# Altium schematic sheet Power management.SchDoc: Power Managemant
size A4; DocumentNumber: 2; SheetNumber: 2; SheetTotal: 3
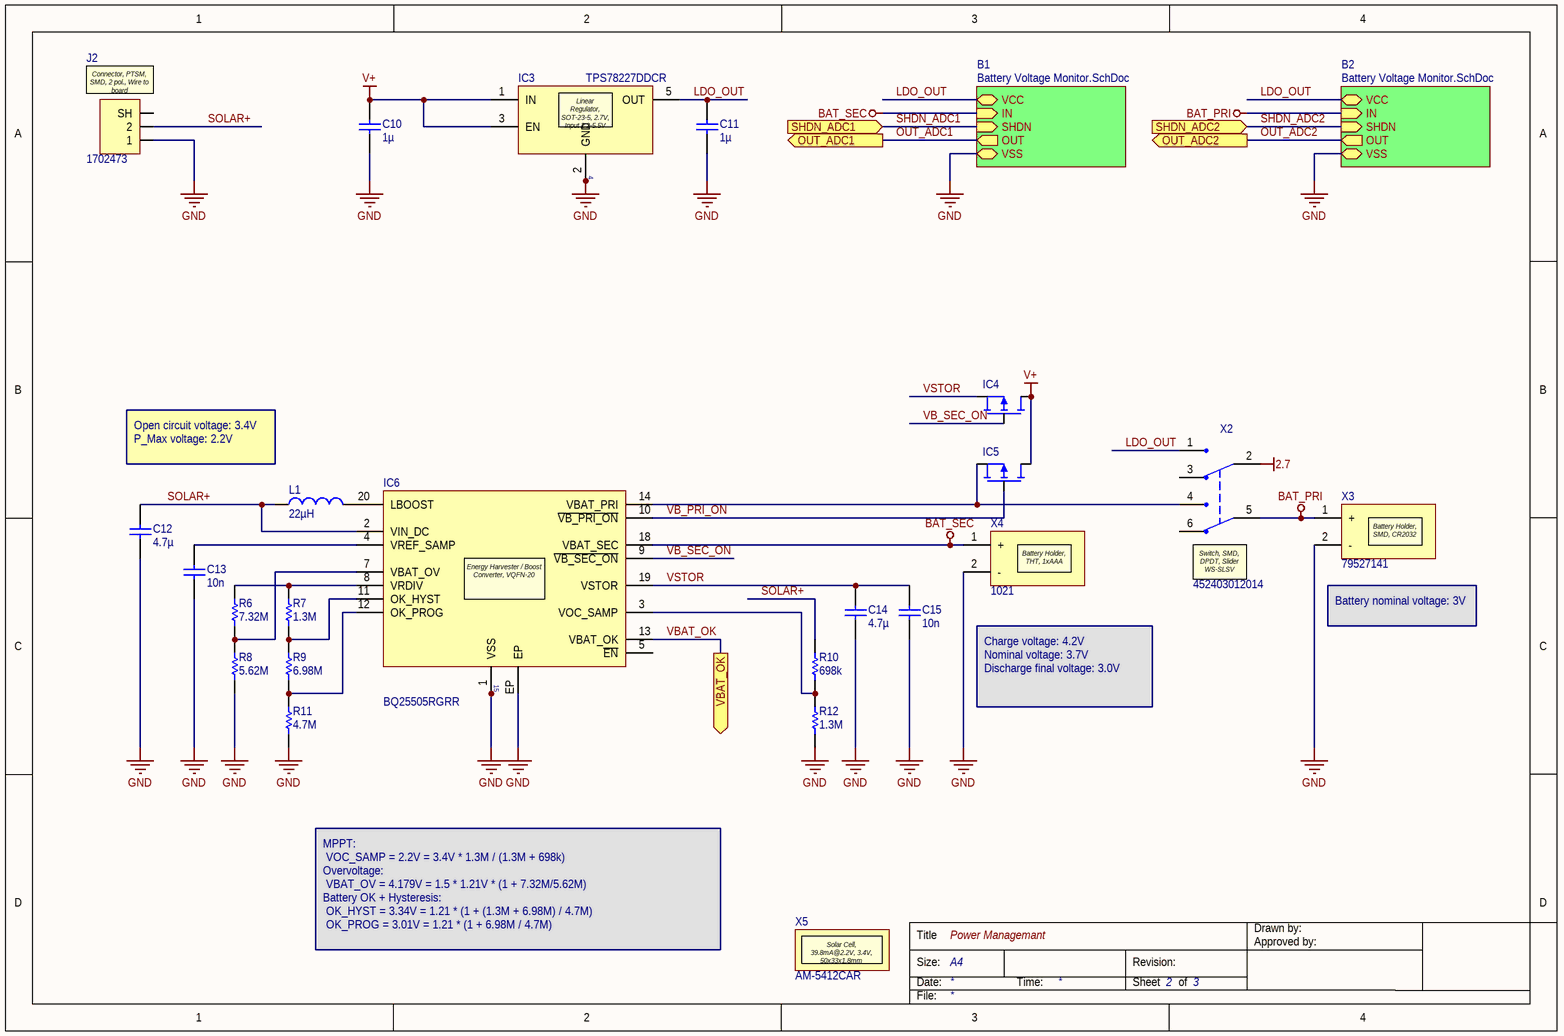
[diagram p0: Power management.SchDoc]

## Parts
C10  value 1µ  [C0805]  (hidden comment: GRM21BR71H105KA12L)
C11  value 1µ  [C0805]  (hidden comment: GRM21BR71H105KA12L)
C12  value 4.7µ  [C0603]  (hidden comment: C0603C475M8PACTU)
C13  value 10n  [C0603]  (hidden comment: C0603C103J3GACTU)
C14  value 4.7µ  [C0603]  (hidden comment: C0603C475M8PACTU)
C15  value 10n  [C0603]  (hidden comment: C0603C103J3GACTU)
IC3  TPS78227DDCR  [SOT-23-5]
IC4  PMZ950UPEL  [SOT-883]  (value not drawn)
IC5  PMZ950UPEL  [SOT-883]  (value not drawn)
IC6  BQ25505RGRR  [VQFN-20-EP_3.5x3.5]
J2  1702473  [1702473]
L1  value 22µH  [WE-TCP_3816]  (hidden comment: 744031220)
R6  value 7.32M  [R0603]  (hidden comment: CRCW06037M32FKEA)
R7  value 1.3M  [R0603]  (hidden comment: CRCW06031M30FKEA)
R8  value 5.62M  [R0603]  (hidden comment: CRCW06035M62FKEA)
R9  value 6.98M  [R0603]  (hidden comment: CRCW06036M98FKEA)
R10  value 698k  [R0603]  (hidden comment: ERJ-3EKF6983V)
R11  value 4.7M  [R0603]  (hidden comment: CRCW06034M70FKEA)
R12  value 1.3M  [R0603]  (hidden comment: CRCW06031M30FKEA)
X2  452403012014  [452403012014]
X3  79527141  [79527141]  (graphical)
X4  MPN: 1021  [Keystone_Electronics_1021]  (hidden comment: Keystone_Electronics_1021)
X5  AM-5412CAR  [AM-5412CAR]

## Sub-sheets
B1 = Battery Voltage Monitor.SchDoc: VCC, VSS, SHDN (in), OUT (out), IN (in)
B2 = Battery Voltage Monitor.SchDoc: VCC, VSS, SHDN (in), OUT (out), IN (in)

## Ports
OUT_ADC1 (out), OUT_ADC2 (out), SHDN_ADC1 (in), SHDN_ADC2 (in), VBAT_OK (out)

## Nets
2.7: X2.2(COM1)
BAT_PRI: X2.5(COM2) X3.1(+) ; sheet B2/IN
BAT_SEC: IC6.18(VBAT_SEC) X4.1(+) ; sheet B1/IN
GND: C10.1 C11.1 C12.1 C13.1 C14.1 C15.1 IC3.2(GND) IC3.4(GND) IC6.1(VSS) IC6.15(VSS) IC6.EP J2.1 R8.1 R11.1 R12.1 X3.2(-) X4.2(-) ; sheet B1/VSS, sheet B2/VSS
V+: C10.2 IC3.1(IN) IC3.3(EN) IC4.3(D) IC5.3(D)
LDO_OUT: C11.2 IC3.5(OUT) X2.1(NO1) ; sheet B1/VCC, sheet B2/VCC
OUT_ADC1: port OUT_ADC1, sheet B1/OUT
OUT_ADC2: port OUT_ADC2, sheet B2/OUT
SHDN_ADC1: port SHDN_ADC1, sheet B1/SHDN
SHDN_ADC2: port SHDN_ADC2, sheet B2/SHDN
SOLAR+: C12.2 IC6.2(VIN_DC) J2.2 L1.1 R10.2
VB_PRI_ON: IC5.1(G) IC6.10(~{VB_PRI_ON})
VB_SEC_ON: IC4.1(G) IC6.9(~{VB_SEC_ON})
VBAT_OK: IC6.13(VBAT_OK) ; port VBAT_OK
VSTOR: C14.2 C15.2 IC4.2(S) IC6.19(VSTOR)
NetC13_2: C13.2 IC6.4(VREF_SAMP)
NetIC5_2: IC5.2(S) IC6.14(VBAT_PRI) X2.4(NO2)
NetIC6_3: IC6.3(VOC_SAMP) R10.1 R12.2
NetIC6_7: IC6.7(VBAT_OV) R6.1 R8.2
NetIC6_8: IC6.8(VRDIV) R6.2 R7.2
NetIC6_11: IC6.11(OK_HYST) R7.1 R9.2
NetIC6_12: IC6.12(OK_PROG) R9.1 R11.2
NetIC6_20: IC6.20(LBOOST) L1.2
NetJ2_SH1: J2.SH1(SH) J2.SH2

Not connected (* = marked no-connect by the designer): IC6 5(~{EN}); X2 3(NC1) 6(NC2)

## Notes on the sheet
- Open circuit voltage: 3.4V
  P_Max voltage: 2.2V
- (near X3) Battery nominal voltage: 3V
- Charge voltage: 4.2V
  Nominal voltage: 3.7V
  Discharge final voltage: 3.0V
- MPPT:
  VOC_SAMP = 2.2V = 3.4V * 1.3M / (1.3M + 698k)
  Overvoltage:
  VBAT_OV = 4.179V = 1.5 * 1.21V * (1 + 7.32M/5.62M)
  Battery OK + Hysteresis:
  OK_HYST = 3.34V = 1.21 * (1 + (1.3M + 6.98M) / 4.7M)
  OK_PROG = 3.01V = 1.21 * (1 + 6.98M / 4.7M)
- Title
- Size:
- Date:
- A4
- Time:
- Revision:
- Sheet
- of
- Drawn by:
- Approved by:
- File:

## Library data of the parts
C10 C11 = GRM21BR71H105KA12L: Cap, 1µ, 0805, 50V, X7R; Manufacturer: Murata; Rated Voltage: 50V; Dielectric: X7R; Temperature: 125°C; ComponentLink2URL: p:\415379.pdf; ComponentLink1Description: Datasheet; ComponentLink2Description: Part Series Datasheet; ComponentLink1URL: p:\2047800.pdf; OC_FEPA: 1029873; Supplier 1: Digi-Key; Supplier Part Number 1: 490-4736-1-ND; Supplier 2: Farnell; Supplier Part Number 2: 1735541; Supplier 3: Mouser; Supplier Part Number 3: 81-GRM21BR71H105KA2L; MPN: GRM21BR71H105KA12L
C12 C14 = C0603C475M8PACTU: Cap, 4.7µ, 0603, X5R, 10V; Manufacturer: Kemet; Rated Voltage: 10V; Dielectric: X5R; ComponentLink2URL: P:/KEM_C1006_X5R_SMD.pdf; ComponentLink2Description: Part Series Datasheet; OC_FEPA: *; MPN: C0603C475M8PACTU; Supplier 1: Digi-Key; Supplier Part Number 1: 399-9100-1-ND; Supplier 2: Farnell; Supplier Part Number 2: 2112834; Supplier 3: Mouser; Supplier Part Number 3: 80-C0603C475M8P
C13 C15 = C0603C103J3GACTU: Cap, 10n, 0603, C0G, 25V; Manufacturer: Kemet; Rated Voltage: 25V; Dielectric: C0G; ComponentLink2URL: P:/KEM_C1003_C0G_SMD.pdf; ComponentLink2Description: Part Series Datasheet; OC_FEPA: *; MPN: C0603C103J3GACTU; Supplier 1: Digi-Key; Supplier Part Number 1: 399-7838-1-ND; Supplier 2: Farnell; Supplier Part Number 2: 1457729; Supplier 3: Mouser; Supplier Part Number 3: 80-C0603C103J3G
IC3 = TPS78227DDCR: Linear Regulator, SOT-23-5, 2.7V, Input 2.2-5.5V; Manufacturer: Texas Instruments; Additional Description: 130mV Dropout, Ultra low quiescent current; ComponentLink1URL: P:/tps782.pdf; ComponentLink1Description: Datasheet; OC_FEPA: *; Supplier 1: Digi-Key; Supplier Part Number 1: 296-23825-1-ND; Supplier 2: Farnell; Supplier Part Number 2: 2352270; Supplier 3: Mouser; Supplier Part Number 3: 595-TPS78227DDCR; Supplier 4: RSComponents; Supplier Part Number 4: 8175436; MPN: TPS78227DDCR
IC4 IC5 = PMZ950UPEL: MOSFET, SOT-883, p-channel, -20V, -0.5A, low leakage current; Manufacturer: Nexperia; ComponentLink1URL: P:/PMZ950UPEL.pdf; ComponentLink1Description: Datasheet; OC_FEPA: *; Supplier 1: Digi-Key; Supplier Part Number 1: 1727-2599-1-ND; Supplier 2: Farnell; Supplier Part Number 2: 2673080; Supplier 3: Mouser; Supplier Part Number 3: 771-PMZ950UPELYL; MPN: PMZ950UPEL
IC6 = BQ25505RGRR: Energy Harvester / Boost Converter, VQFN-20; Manufacturer: Texas Instruments; ComponentLink1URL: P:/bq25505.pdf; ComponentLink1Description: Datasheet; OC_FEPA: *; MPN: BQ25505RGRR; Supplier 1: Digi-Key; Supplier Part Number 1: 296-37078-1-ND; Supplier 2: Farnell; Supplier Part Number 2: -; Supplier 3: Mouser; Supplier Part Number 3: 595-BQ25505RGRR
J2 = 1702473: Connector, PTSM, SMD, 2 pol., Wire to board; Manufacturer: Phoenix Contact; ComponentLink1URL: P:/1702473.pdf; ComponentLink1Description: Datasheet; OC_FEPA: *; ComponentLink3Description: Drawing; ComponentLink3URL: P:/pxc_1702473_01_PTSM-0-5-2-2-5-H-SMD-R24_FAM.pdf; Supplier 1: Digi-Key; Supplier Part Number 1: 277-2337-1-ND; Supplier 2: Farnell; Supplier Part Number 2: 1793797; Supplier 3: Mouser; Supplier Part Number 3: 651-1702473; MPN: 1702473
L1 = 744031220: Ind, 22µH, 0.51A, 3.8x3.8x1.65mm; Manufacturer: Würth Elektronik; OC_FEPA: *; ComponentLink3Description: Drawing; ComponentLink3URL: P:/744031220.pdf; MPN: 744031220; Supplier 1: Digi-Key; Supplier Part Number 1: 732-1012-1-ND; Supplier 2: Farnell; Supplier Part Number 2: 1890602; Supplier 3: Mouser; Supplier Part Number 3: 710-744031220; Supplier 4: RSComponents; Supplier Part Number 4: 617-0903
R6 = CRCW06037M32FKEA: Res, 7.32M, 0603, 1%, 75V, 100mW; Manufacturer: Vishay Dale; Temperature Coefficient: 100ppm; Rated Voltage: 75V; Tolerance: 1%; Type: Thick Film; Rated Power: 100mW; OC_FEPA: *; ComponentLink2URL: P:/dcrcwe3.pdf; ComponentLink2Description: Part Series Datasheet; MPN: CRCW06037M32FKEA; Supplier 1: Digi-Key; Supplier Part Number 1: 541-7.32MHCT-ND; Supplier 2: Farnell; Supplier Part Number 2: 2138713; Supplier 3: Mouser; Supplier Part Number 3: 71-CRCW06037M32FKEA
R7 R12 = CRCW06031M30FKEA: Res, 1.3M, 0603, 1%, 75V, 100mW; Manufacturer: Vishay Dale; Temperature Coefficient: 100ppm; Rated Voltage: 75V; Tolerance: 1%; Type: Thick Film; Rated Power: 100mW; OC_FEPA: *; ComponentLink2URL: P:/dcrcwe3.pdf; ComponentLink2Description: Part Series Datasheet; MPN: CRCW06031M30FKEA; Supplier 1: Digi-Key; Supplier Part Number 1: 541-1.30MHCT-ND; Supplier 2: Farnell; Supplier Part Number 2: 2138620; Supplier 3: Mouser; Supplier Part Number 3: 71-CRCW06031M30FKEA
R8 = CRCW06035M62FKEA: Res, 5.62M, 0603, 1%, 75V, 100mW; Manufacturer: Vishay Dale; Temperature Coefficient: 100ppm; Rated Voltage: 75V; Tolerance: 1%; Type: Thick Film; Rated Power: 100mW; OC_FEPA: *; ComponentLink2URL: P:/dcrcwe3.pdf; ComponentLink2Description: Part Series Datasheet; MPN: CRCW06035M62FKEA; Supplier 1: Digi-Key; Supplier Part Number 1: 541-5.62MHCT-ND; Supplier 2: Farnell; Supplier Part Number 2: 2138698; Supplier 3: Mouser; Supplier Part Number 3: 71-CRCW06035M62FKEA
R9 = CRCW06036M98FKEA: Res, 6.98M, 0603, 1%, 75V, 100mW; Manufacturer: Vishay Dale; Temperature Coefficient: 100ppm; Rated Voltage: 75V; Tolerance: 1%; Type: Thick Film; Rated Power: 100mW; OC_FEPA: *; ComponentLink2URL: P:/dcrcwe3.pdf; ComponentLink2Description: Part Series Datasheet; MPN: CRCW06036M98FKEA; Supplier 1: Digi-Key; Supplier Part Number 1: 541-6.98MHCT-ND; Supplier 2: Farnell; Supplier Part Number 2: 2138710; Supplier 3: Mouser; Supplier Part Number 3: 71-CRCW06036M98FKEA
R10 = ERJ-3EKF6983V: Res, 698k, 0603, 1%, 75V, 100mW; Manufacturer: Panasonic Electronic Components; Temperature Coefficient: 100ppm; Rated Voltage: 75V; Tolerance: 1%; Type: Thick Film; Rated Power: 100mW; OC_FEPA: *; ComponentLink2URL: P:/AOA0000C304.pdf; ComponentLink2Description: Part Series Datasheet; MPN: ERJ-3EKF6983V; Supplier 1: Digi-Key; Supplier Part Number 1: P698KHCT-ND; Supplier 2: Farnell; Supplier Part Number 2: 2303307; Supplier 3: Mouser; Supplier Part Number 3: 667-ERJ-3EKF6983V
R11 = CRCW06034M70FKEA: Res, 4.7M, 0603, 1%, 75V, 100mW; Manufacturer: Vishay Dale; Temperature Coefficient: 100ppm; Rated Voltage: 75V; Tolerance: 1%; Type: Thick Film; Rated Power: 100mW; OC_FEPA: *; ComponentLink2URL: P:/dcrcwe3.pdf; ComponentLink2Description: Part Series Datasheet; MPN: CRCW06034M70FKEA; Supplier 1: Digi-Key; Supplier Part Number 1: 541-4.70MHCT-ND; Supplier 2: Farnell; Supplier Part Number 2: 2138688; Supplier 3: Mouser; Supplier Part Number 3: 71-CRCW0603-4.7M-E3
X2 = 452403012014: Switch, SMD, DPDT, Slider WS-SLSV; Manufacturer: Würth Elektronik; OC_FEPA: *; ComponentLink3Description: Drawing; ComponentLink3URL: P:/452403012014.pdf; Supplier 1: Digi-Key; Supplier Part Number 1: 732-10145-1-ND; Supplier 2: Farnell; Supplier Part Number 2: -; Supplier 3: Mouser; Supplier Part Number 3: 710-452403012014; MPN: 452403012014
X3 = 79527141: Battery Holder, SMD, CR2032; Manufacturer: Würth Elektronik; OC_FEPA: *; ComponentLink3Description: Drawing; ComponentLink3URL: P:/79527141.pdf; Supplier 1: Digi-Key; Supplier Part Number 1: 732-12325-1-ND; Supplier 2: Farnell; Supplier Part Number 2: -; Supplier 3: Mouser; Supplier Part Number 3: 710-79527141; Supplier 4: RSComponents; Supplier Part Number 4: 1842347; MPN: 79527141
X4 = Keystone_Electronics_1021: Battery Holder, THT, 1xAAA; Manufacturer: Keystone Electronics; OC_FEPA: *; ComponentLink2Description: Part Series Datasheet; ComponentLink2URL: P:/M65p22.pdf; ComponentLink3Description: Drawing; ComponentLink3URL: P:/1021.PDF; Supplier 1: Digi-Key; Supplier Part Number 1: 36-1021-ND; Supplier 2: Farnell; Supplier Part Number 2: -; Supplier 3: Mouser; Supplier Part Number 3: 534-1021; Supplier 4: Conrad; Supplier Part Number 4: 1555480
X5 = AM-5412CAR: Solar Cell, 39.8mA@2.2V, 3.4V, 50x33x1.8mm; Manufacturer: Panasonic BSG; OC_FEPA: *; ComponentLink2Description: Part Series Datasheet; ComponentLink2URL: P:/Amorphous_Br.pdf; Supplier 1: Digi-Key; Supplier Part Number 1: 869-1007-ND; Supplier 2: Farnell; Supplier Part Number 2: -; Supplier 3: Mouser; Supplier Part Number 3: 658-AM-5412CAR; MPN: AM-5412CAR